# Altium schematic sheet FPGA_CPU_EBI1.SchDoc
size A4 portrait
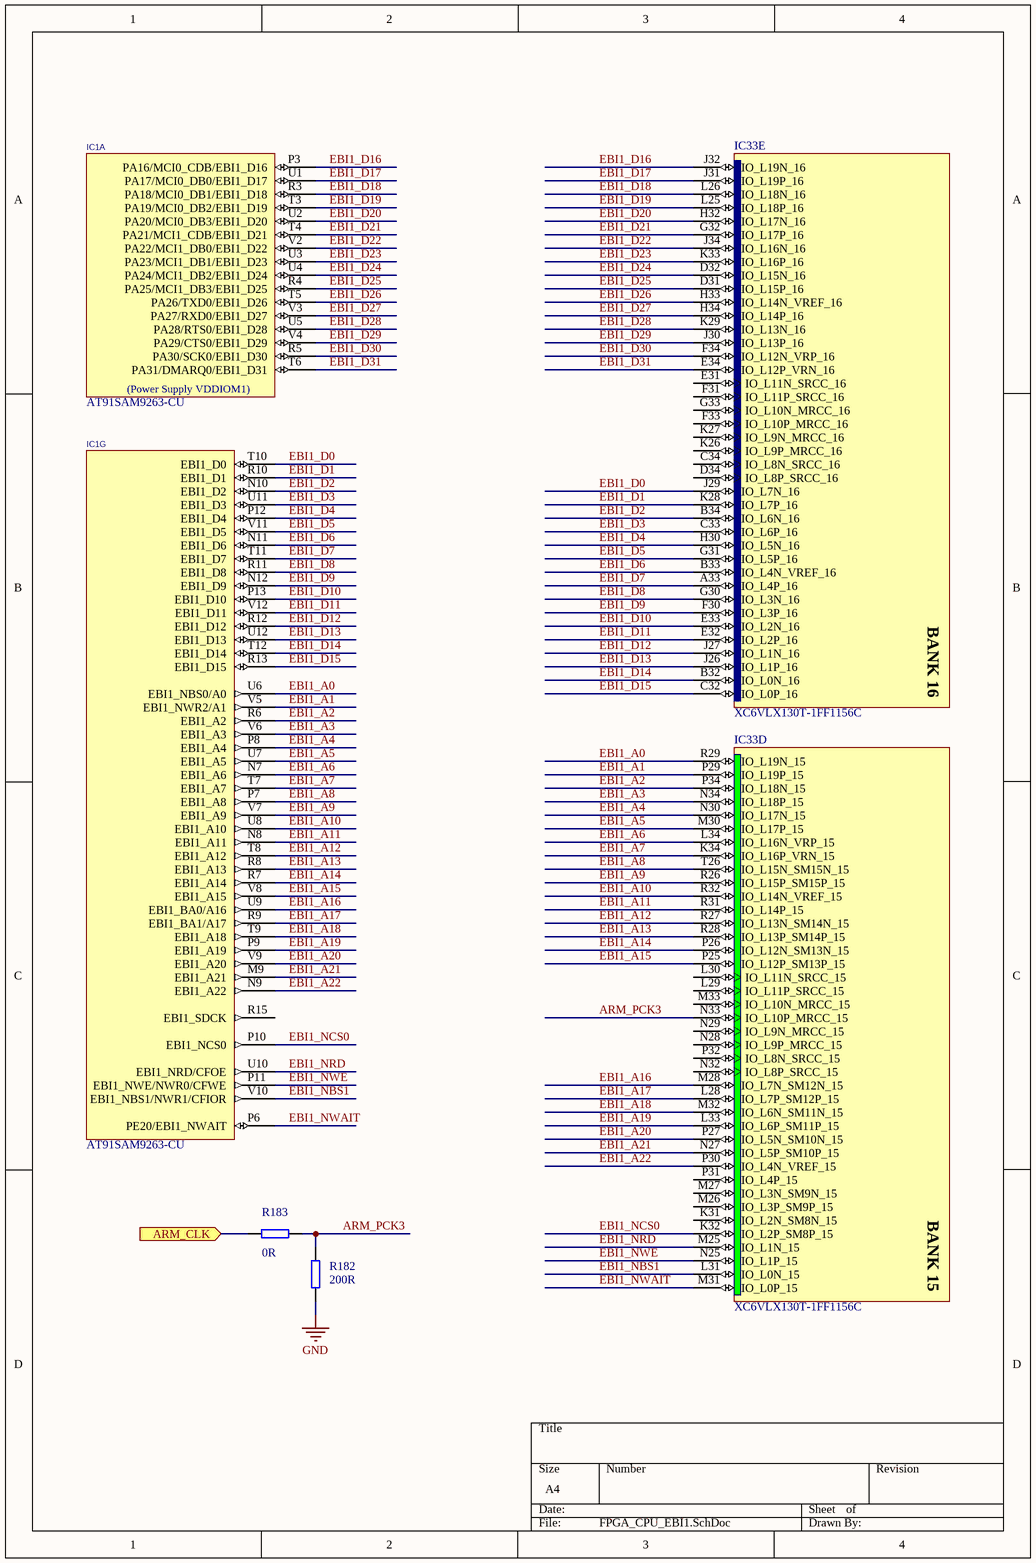
[diagram p0: FPGA_CPU_EBI1.SchDoc]

## Parts
IC1  AT91SAM9263-CU  [TFBGA324]  (parts A,G of 12)
IC33  XC6VLX130T-1FF1156C  [FF1156]  (parts D,E of 20)
R182  200R  [0402]
R183  value 0R  [0402]  (hidden comment: Jumper)

## Ports
ARM_CLK (in)

## Nets
GND: R182.1
ARM_CLK: R183.1 ; port ARM_CLK
ARM_PCK3: IC33.N33(IO_L10P_MRCC_15) R182.2 R183.2
EBI1_A0: IC1.U6(EBI1_NBS0/A0) IC33.R29(IO_L19N_15)
EBI1_A1: IC1.V5(EBI1_NWR2/A1) IC33.P29(IO_L19P_15)
EBI1_A2: IC1.R6(EBI1_A2) IC33.P34(IO_L18N_15)
EBI1_A3: IC1.V6(EBI1_A3) IC33.N34(IO_L18P_15)
EBI1_A4: IC1.P8(EBI1_A4) IC33.N30(IO_L17N_15)
EBI1_A5: IC1.U7(EBI1_A5) IC33.M30(IO_L17P_15)
EBI1_A6: IC1.N7(EBI1_A6) IC33.L34(IO_L16N_VRP_15)
EBI1_A7: IC1.T7(EBI1_A7) IC33.K34(IO_L16P_VRN_15)
EBI1_A8: IC1.P7(EBI1_A8) IC33.T26(IO_L15N_SM15N_15)
EBI1_A9: IC1.V7(EBI1_A9) IC33.R26(IO_L15P_SM15P_15)
EBI1_A10: IC1.U8(EBI1_A10) IC33.R32(IO_L14N_VREF_15)
EBI1_A11: IC1.N8(EBI1_A11) IC33.R31(IO_L14P_15)
EBI1_A12: IC1.T8(EBI1_A12) IC33.R27(IO_L13N_SM14N_15)
EBI1_A13: IC1.R8(EBI1_A13) IC33.R28(IO_L13P_SM14P_15)
EBI1_A14: IC1.R7(EBI1_A14) IC33.P26(IO_L12N_SM13N_15)
EBI1_A15: IC1.V8(EBI1_A15) IC33.P25(IO_L12P_SM13P_15)
EBI1_A16: IC1.U9(EBI1_BA0/A16) IC33.M28(IO_L7N_SM12N_15)
EBI1_A17: IC1.R9(EBI1_BA1/A17) IC33.L28(IO_L7P_SM12P_15)
EBI1_A18: IC1.T9(EBI1_A18) IC33.M32(IO_L6N_SM11N_15)
EBI1_A19: IC1.P9(EBI1_A19) IC33.L33(IO_L6P_SM11P_15)
EBI1_A20: IC1.V9(EBI1_A20) IC33.P27(IO_L5N_SM10N_15)
EBI1_A21: IC1.M9(EBI1_A21) IC33.N27(IO_L5P_SM10P_15)
EBI1_A22: IC1.N9(EBI1_A22) IC33.P30(IO_L4N_VREF_15)
EBI1_D0: IC1.T10(EBI1_D0) IC33.J29(IO_L7N_16)
EBI1_D1: IC1.R10(EBI1_D1) IC33.K28(IO_L7P_16)
EBI1_D2: IC1.N10(EBI1_D2) IC33.B34(IO_L6N_16)
EBI1_D3: IC1.U11(EBI1_D3) IC33.C33(IO_L6P_16)
EBI1_D4: IC1.P12(EBI1_D4) IC33.H30(IO_L5N_16)
EBI1_D5: IC1.V11(EBI1_D5) IC33.G31(IO_L5P_16)
EBI1_D6: IC1.N11(EBI1_D6) IC33.B33(IO_L4N_VREF_16)
EBI1_D7: IC1.T11(EBI1_D7) IC33.A33(IO_L4P_16)
EBI1_D8: IC1.R11(EBI1_D8) IC33.G30(IO_L3N_16)
EBI1_D9: IC1.N12(EBI1_D9) IC33.F30(IO_L3P_16)
EBI1_D10: IC1.P13(EBI1_D10) IC33.E33(IO_L2N_16)
EBI1_D11: IC1.V12(EBI1_D11) IC33.E32(IO_L2P_16)
EBI1_D12: IC1.R12(EBI1_D12) IC33.J27(IO_L1N_16)
EBI1_D13: IC1.U12(EBI1_D13) IC33.J26(IO_L1P_16)
EBI1_D14: IC1.T12(EBI1_D14) IC33.B32(IO_L0N_16)
EBI1_D15: IC1.R13(EBI1_D15) IC33.C32(IO_L0P_16)
EBI1_D16: IC1.P3(PA16/MCI0_CDB/EBI1_D16) IC33.J32(IO_L19N_16)
EBI1_D17: IC1.U1(PA17/MCI0_DB0/EBI1_D17) IC33.J31(IO_L19P_16)
EBI1_D18: IC1.R3(PA18/MCI0_DB1/EBI1_D18) IC33.L26(IO_L18N_16)
EBI1_D19: IC1.T3(PA19/MCI0_DB2/EBI1_D19) IC33.L25(IO_L18P_16)
EBI1_D20: IC1.U2(PA20/MCI0_DB3/EBI1_D20) IC33.H32(IO_L17N_16)
EBI1_D21: IC1.T4(PA21/MCI1_CDB/EBI1_D21) IC33.G32(IO_L17P_16)
EBI1_D22: IC1.V2(PA22/MCI1_DB0/EBI1_D22) IC33.J34(IO_L16N_16)
EBI1_D23: IC1.U3(PA23/MCI1_DB1/EBI1_D23) IC33.K33(IO_L16P_16)
EBI1_D24: IC1.U4(PA24/MCI1_DB2/EBI1_D24) IC33.D32(IO_L15N_16)
EBI1_D25: IC1.R4(PA25/MCI1_DB3/EBI1_D25) IC33.D31(IO_L15P_16)
EBI1_D26: IC1.T5(PA26/TXD0/EBI1_D26) IC33.H33(IO_L14N_VREF_16)
EBI1_D27: IC1.V3(PA27/RXD0/EBI1_D27) IC33.H34(IO_L14P_16)
EBI1_D28: IC1.U5(PA28/RTS0/EBI1_D28) IC33.K29(IO_L13N_16)
EBI1_D29: IC1.V4(PA29/CTS0/EBI1_D29) IC33.J30(IO_L13P_16)
EBI1_D30: IC1.R5(PA30/SCK0/EBI1_D30) IC33.F34(IO_L12N_VRP_16)
EBI1_D31: IC1.T6(PA31/DMARQ0/EBI1_D31) IC33.E34(IO_L12P_VRN_16)
EBI1_NBS1: IC1.V10(EBI1_NBS1/NWR1/CFIOR) IC33.L31(IO_L0N_15)
EBI1_NCS0: IC1.P10(EBI1_NCS0) IC33.K32(IO_L2P_SM8P_15)
EBI1_NRD: IC1.U10(EBI1_NRD/CFOE) IC33.M25(IO_L1N_15)
EBI1_NWAIT: IC1.P6(PE20/EBI1_NWAIT) IC33.M31(IO_L0P_15)
EBI1_NWE: IC1.P11(EBI1_NWE/NWR0/CFWE) IC33.N25(IO_L1P_15)

Not connected (* = marked no-connect by the designer): IC1 R15(EBI1_SDCK); IC33 C34(IO_L8N_SRCC_16) D34(IO_L8P_SRCC_16) E31(IO_L11N_SRCC_16) F31(IO_L11P_SRCC_16) F33(IO_L10P_MRCC_16) G33(IO_L10N_MRCC_16) K26(IO_L9P_MRCC_16) K27(IO_L9N_MRCC_16) K31(IO_L2N_SM8N_15) L29(IO_L11P_SRCC_15) L30(IO_L11N_SRCC_15) M26(IO_L3P_SM9P_15) M27(IO_L3N_SM9N_15) M33(IO_L10N_MRCC_15) N28(IO_L9P_MRCC_15) N29(IO_L9N_MRCC_15) N32(IO_L8P_SRCC_15) P31(IO_L4P_15) P32(IO_L8N_SRCC_15)

## Notes on the sheet
- (in symbol AT91SAM9263, part A) (Power Supply VDDIOM1)
- (in symbol XC6VLX130T-1FF1156C, part D) BANK 15
- (in symbol XC6VLX130T-1FF1156C, part E) BANK 16

## Library data of the parts
IC1 = AT91SAM9263: Atmel ARM926 MCU; Supplier: EBV; RefId: AT91SAM9263-CU; Value: AT91SAM9263-CU
IC33 = XC6VLX130T-1FF1156C: Virtex-6 LXT Platform FPGA, 600 User I/Os, 20 GTXs, 1156-Ball FFBGA, Speed Grade 1, Commercial Grade; FirstPublished: 17-Nov-2009; DatasheetVersion: v2.0, Sep-2009; PackageVersion: ver1.0, Jun-2009; PackageReference: FF1156; Publisher: Altium Limited; PackageDescription: 1156-Ball Flip-Chip Fine Pitch Ball Grid Array (FF1156); Code_JEDEC: MS-034-AAR-1; Code_IPC: BGA100P34X34-1156; ComponentLink1Description: Virtex-6 Datasheet; ComponentLink1URL: http://www.xilinx.com/support/documentation/data_sheets/ds150.pdf; ComponentLink2Description: Pinout Specification; ComponentLink2URL: http://www.xilinx.com/support/packagefiles/virtex-6-pkgs.htm; ComponentLink3Description: FF1156 Package Drawing; ComponentLink3URL: http://www.xilinx.com/support/documentation/package_specs/ff1156.pdf; ComponentLink4Description: Virtex-6 Documents; ComponentLink4URL: http://www.xilinx.com/support/documentation/virtex-6.htm; ComponentLink5Description: Xilinx.com Home; ComponentLink5URL: http://www.xilinx.com
R182 = R0402_200R_±1%_0.1W_100PPM: SMD Resistor; Manufacturer1: Panasonic; Manufacturer1 PN: ERJ-2RKF2000X; TCR: 100ppm; Power Rating: 0.1W; Tolerance: ±1%; Case: 0402; Distributor1: DigiKey; Distributor1 PN: P200LCT-ND; Value: 200R
R183 = R0402_0R_0.1W_JUMPER: SMD Resistor; Manufacturer1: Panasonic; Manufacturer1 PN: ERJ-2GE0R00X; TCR: 100ppm; Power Rating: 0.1W; Case: 0402; Distributor1: DigiKey; Distributor1 PN: P0.0JCT-ND; Tolerance: Jumper